# Altium schematic sheet line_follower.SchDoc
size A4
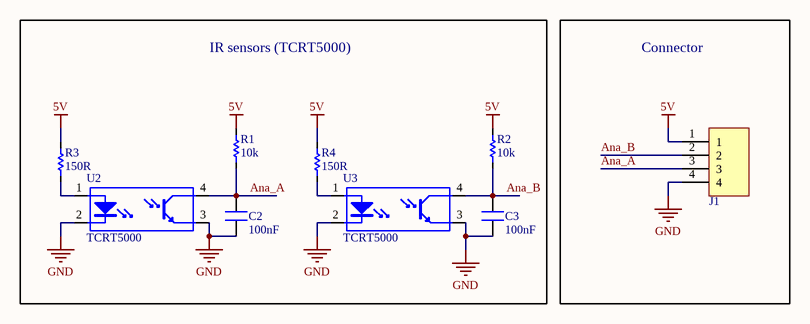
[diagram p0: line_follower.SchDoc]

## Parts
C2  value 100nF  [C0603]  (hidden comment: C)
C3  value 100nF  [C0603]  (hidden comment: C)
J1  CONN_4P  [JST B4B-PH-K-S]  (value not drawn)
R1  value 10k  [R0603]  (hidden comment: R)
R2  value 10k  [R0603]  (hidden comment: R)
R3  value 150R  [R0603]  (hidden comment: R)
R4  value 150R  [R0603]  (hidden comment: R)
U2  TCRT5000  [TCRT5000]
U3  TCRT5000  [TCRT5000]

## Blocks framed on the sheet
IR sensors (TCRT5000): C2 C3 R1-R4 U2 U3
Connector: J1

## Nets
5V: J1.1 R1.2 R2.2 R3.2 R4.2
GND: C2.1 C3.1 J1.4 U2.2(K) U2.3(E) U3.2(K) U3.3(E)
Ana_A: C2.2 J1.3 R1.1 U2.4(C)
Ana_B: C3.2 J1.2 R2.1 U3.4(C)
NetR3_1: R3.1 U2.1(A)
NetR4_1: R4.1 U3.1(A)

## Library data of the parts
C2 C3 = C: Ceramic Capacitor SMD
J1 = CONN_4P: Connector, 4P
R1-R4 = R: Resistor SMD
U2 U3 = TCRT5000: Reflective Optical Sensor with Transistor Output